# EAGLE design nav (EAGLE 7.4.0)
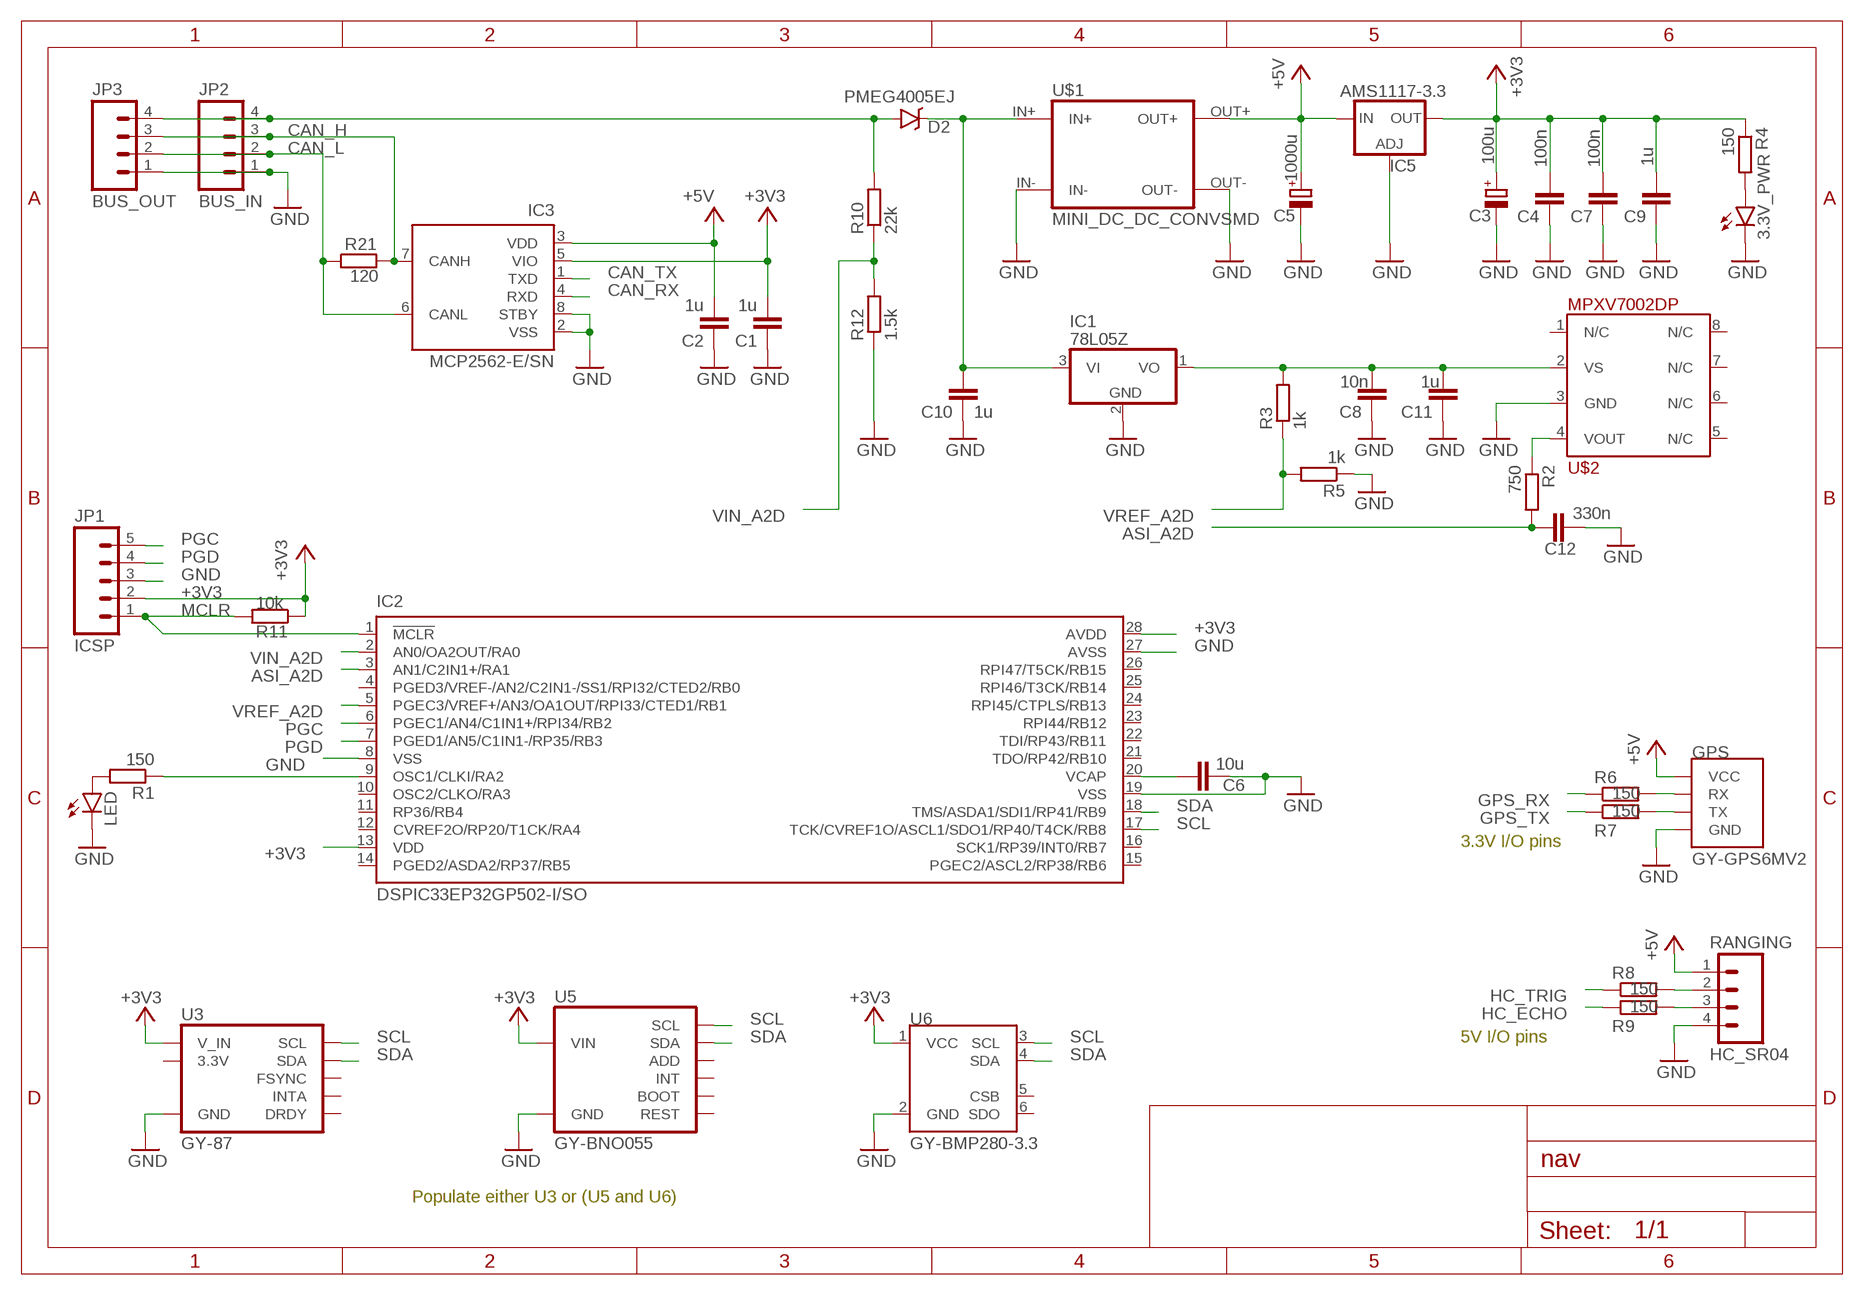
[diagram p0: schematic, sheet 1]

## Parts
3.3V_PWR  LED-FKIT-1206  [FKIT-LED-1206]
C1  1u  C-EUC0603K  [C0603K]
C2  1u  C-EUC0603K  [C0603K]
C3  100u  CPOL-EUE2.5-7  [E2,5-7]
C4  100n  C-EUC0603K  [C0603K]
C5  1000u  CPOL-EUE3.5-8  [E3,5-8]
C6  10u  C-EUC0805K  [C0805K]
C7  100n  C-EUC0603K  [C0603K]
C8  10n  C-EUC0603K  [C0603K]
C9  1u  C-EUC0603  [C0603]
C10  1u  C-EUC0603  [C0603]
C11  1u  C-EUC0603K  [C0603K]
C12  330n  C-EUC0603K  [C0603K]
D2  PMEG4005EJ  DIODE-SCHOTTKY-PMEG4005EJ  [SOD-323]
GPS  GY-GPS6MV2  [GY-GPS6MV2]
IC1  78L05Z  [TO92]
IC2  DSPIC33EP32GP502-I/SO  [SO28W]
IC3  MCP2562-E/SN  [SO-08]
IC5  AMS1117-3.3  LD117AS33TR  [SOT223]
JP1  ICSP  M05PTH  [1X05]
JP2  BUS_IN  M04PTH  [1X04]
JP3  BUS_OUT  M04PTH  [1X04]
LED  LED-FKIT-1206  [FKIT-LED-1206]
R1  150  R-EU_R0603  [R0603]
R2  750  R-EU_R0603  [R0603]
R3  1k  R-EU_R0603  [R0603]
R4  150  R-EU_R0603  [R0603]
R5  1k  R-EU_R0603  [R0603]
R6  150  R-EU_R0603  [R0603]
R7  150  R-EU_R0603  [R0603]
R8  150  R-EU_R0603  [R0603]
R9  150  R-EU_R0603  [R0603]
R10  22k  R-EU_R0603  [R0603]
R11  10k  R-EU_R0603  [R0603]
R12  1.5k  R-EU_R0603  [R0603]
R21  120  R-EU_R0603  [R0603]
RANGING  HC_SR04  M04PTH  [1X04]
U3  GY-87  [GY-87]
U5  GY-BNO055  [GY-BNO055]
U6  GY-BMP280-3.3  [GY-BMP280-3.3]
U$1  MINI_DC_DC_CONVSMD  [DSN-MINI-360-SMD]
U$2  MPXV7002DP  [MPXV7002DP]

## Nets
+3V3: C1.2 C3.+ C4.2 C7.2 C9.2 IC2.13(VDD) IC2.28(AVDD) IC3.5(VIO) IC5.2(OUT) IC5.@2(OUT) JP1.2 R4.1 R11.1 U3.VCC_IN(V_IN) U5.VIN U6.1(VCC)
+5V: C2.2 C5.+ GPS.VCC IC3.3(VDD) IC5.3(IN) RANGING.1 U$1.OUT+
ASI_A2D: C12.2 IC2.3(AN1/C2IN1+/RA1) R2.2
CAN_H: IC3.7(CANH) JP2.3 JP3.3 R21.2
CAN_L: IC3.6(CANL) JP2.2 JP3.2 R21.1
CAN_RX: IC3.4(RXD)
CAN_TX: IC3.1(TXD)
GND: 3.3V_PWR.C C1.1 C2.1 C3.- C4.1 C5.- C6.1 C7.1 C8.1 C9.1 C10.1 C11.1 C12.1 GPS.GND IC1.2(GND) IC2.8(VSS) IC2.19(VSS) IC2.27(AVSS) IC3.2(VSS) IC3.8(STBY) IC5.1(ADJ) JP1.3 JP2.1 JP3.1 LED.C R5.1 R12.1 RANGING.4 U3.GND U5.GND U6.2(GND) U$1.IN- U$1.OUT- U$2.3(GND)
GPS_RX: R6.1
GPS_TX: R7.1
HC_ECHO: R9.1
HC_TRIG: R8.1
MCLR: IC2.1(!MCLR!) JP1.1 R11.2
N$1: C8.2 C11.2 IC1.1(VO) R3.2 U$2.2(VS)
N$2: GPS.RX R6.2
N$3: 3.3V_PWR.A R4.2
N$4: LED.A R1.2
N$5: R2.1 U$2.4(VOUT)
N$6: GPS.TX R7.2
N$7: R8.2 RANGING.2
N$8: R9.2 RANGING.3
N$10: IC2.9(OSC1/CLKI/RA2) R1.1
PGC: IC2.6(PGEC1/AN4/C1IN1+/RPI34/RB2) JP1.5
PGD: IC2.7(PGED1/AN5/C1IN1-/RP35/RB3) JP1.4
SCL: IC2.17(TCK/CVREF1O/ASCL1/SDO1/RP40/T4CK/RB8) U3.SCL U5.SCL U6.3(SCL)
SDA: IC2.18(TMS/ASDA1/SDI1/RP41/RB9) U3.SDA U5.SDA U6.4(SDA)
VCAP: C6.2 IC2.20(VCAP)
VIN: D2.A JP2.4 JP3.4 R10.2
VIN_A2D: IC2.2(AN0/OA2OUT/RA0) R10.1 R12.2
VIN_D: C10.2 D2.C IC1.3(VI) U$1.IN+
VREF_A2D: IC2.5(PGEC3/VREF+/AN3/OA1OUT/RPI33/CTED1/RB1) R3.1 R5.2
Unconnected: IC2.4(PGED3/VREF-/AN2/C2IN1-/SS1/RPI32/CTED2/RB0) IC2.10(OSC2/CLKO/RA3) IC2.11(RP36/RB4) IC2.12(CVREF2O/RP20/T1CK/RA4) IC2.14(PGED2/ASDA2/RP37/RB5) IC2.15(PGEC2/ASCL2/RP38/RB6) IC2.16(SCK1/RP39/INT0/RB7) IC2.21(TDO/RP42/RB10) IC2.22(TDI/RP43/RB11) IC2.23(RPI44/RB12) IC2.24(RPI45/CTPLS/RB13) IC2.25(RPI46/T3CK/RB14) IC2.26(RPI47/T5CK/RB15) U3.DRDY U3.FSYNC U3.INTA U5.ADD U5.BOOT U5.INT U5.REST U6.5(CSB) U6.6(SDO) U$2.1(N/C) U$2.5(N/C) U$2.6(N/C) U$2.7(N/C) U$2.8(N/C)

## Notes on the sheet
- 3.3V I/O pins
- 5V I/O pins
- Populate either U3 or (U5 and U6)

## Power pins joined to a net without a drawn wire
3.3V: U3.3.3V

## Library data of the parts
3.3V_PWR LED = SparkFun-LED:LED: LEDs Standard schematic elements and footprints for 5mm, 3mm, 1206, and 0603 sized LEDs. 5mm - Spark Fun Electronics SKU : COM-00529 (and others)
C1 C2 C4 C6-C12 = rcl:C-EU: CAPACITOR, European symbol
C3 C5 = rcl:CPOL-EU: POLARIZED CAPACITOR, European symbol
D2 = SparkFun-DiscreteSemi:DIODE-SCHOTTKY: Schottky diodes in SFE's production catalog BAT20J 1A 23V 0.62Vf RB751 120mA 40V 0.37Vf PMEG4005EJ 0.5A 40V 0.42Vf MBRA140 1A 40V 0.5Vf B340A 3A 40V SMA; PROD_ID: DIO-10955
GPS = aliexpress_modules:GY-GPS6MV2: Ublox NEO6M Module. Onboard linear 3.3V LDO regulator
IC1 = linear:78*: Positive VOLTAGE REGULATOR Source: http://cache.national.com/ds/LM/LM78L05.pdf http://www.fairchildsemi.com/ds/LM/LM7805.pdf
IC2 = microchip:DSPIC33EP*502?: 16-Bit Microcontrollers and Digital Signal Controllers with High-Speed PWM, Op Amps and Advanced Analog Source: ww1.microchip.com/downloads/en/DeviceDoc/70000657H.pdf
IC3 = microchip:MCP2562: High-Speed CAN Transceiver Source: http://ww1.microchip.com/downloads/en/DeviceDoc/20005167C.pdf
IC5 = v-reg:LD117A?*: Low drop fixed and adjustable positive voltage regulators 1 A Source: http://www.st.com/stonline/products/literature/ds/7194/ld1117axx.pdf
JP1 = SparkFun-Connectors:M05: Header 5 Standard 5-pin 0.1" header. Use with straight break away headers (SKU : PRT-00116), right angle break away headers (PRT-00553), swiss pins (PRT-00743), machine pins (PRT-00117), and female headers (PRT-00115). Molex polarized connector foot print use with SKU : PRT-08230 with associated crimp pins and housings.
JP2 JP3 RANGING = SparkFun-Connectors:M04: Header 4 Standard 4-pin 0.1" header. Use with straight break away headers (SKU : PRT-00116), right angle break away headers (PRT-00553), swiss pins (PRT-00743), machine pins (PRT-00117), and female headers (PRT-00115). Molex polarized connector foot print use with SKU : PRT-08231 with associated crimp pins and housings. 1MM SMD Version SKU: PRT-10208
R1-R12 R21 = rcl:R-EU_: RESISTOR, European symbol
U3 = aliexpress_modules:GY-87: GY-87 10DOF MPU6050 HMC5883L BMP180 module
U5 = aliexpress_modules:GY-BNO055: GY-BNO055 9DOF module with sensor fusion algorithms. Internal 10k pullups on ADD,BOOT,SCL,SDA,REST
U6 = aliexpress_modules:GY-BMP280-3.3: High Precision Atmospheric Pressure Sensor Module For Arduino
U$1 = aliexpress_modules:MINI_DC_DC_CONV: RC Airplane Module Mini 360 DC Buck Converter Step Down Module 4.75V-23V to 1V-17V 17x11x3.8mm New LM2596; $1.06 Input voltage: 4.75V-23V; Output voltage: 1.0V-17V; Current output: peak 3A, 1.8A long time
U$2 = aliexpress_modules:MPXV7002DP: MPXV7002 Integrated Silicon Pressure Sensor On-Chip Signal Conditioned, Temperature Compensated and Calibrated

## Board
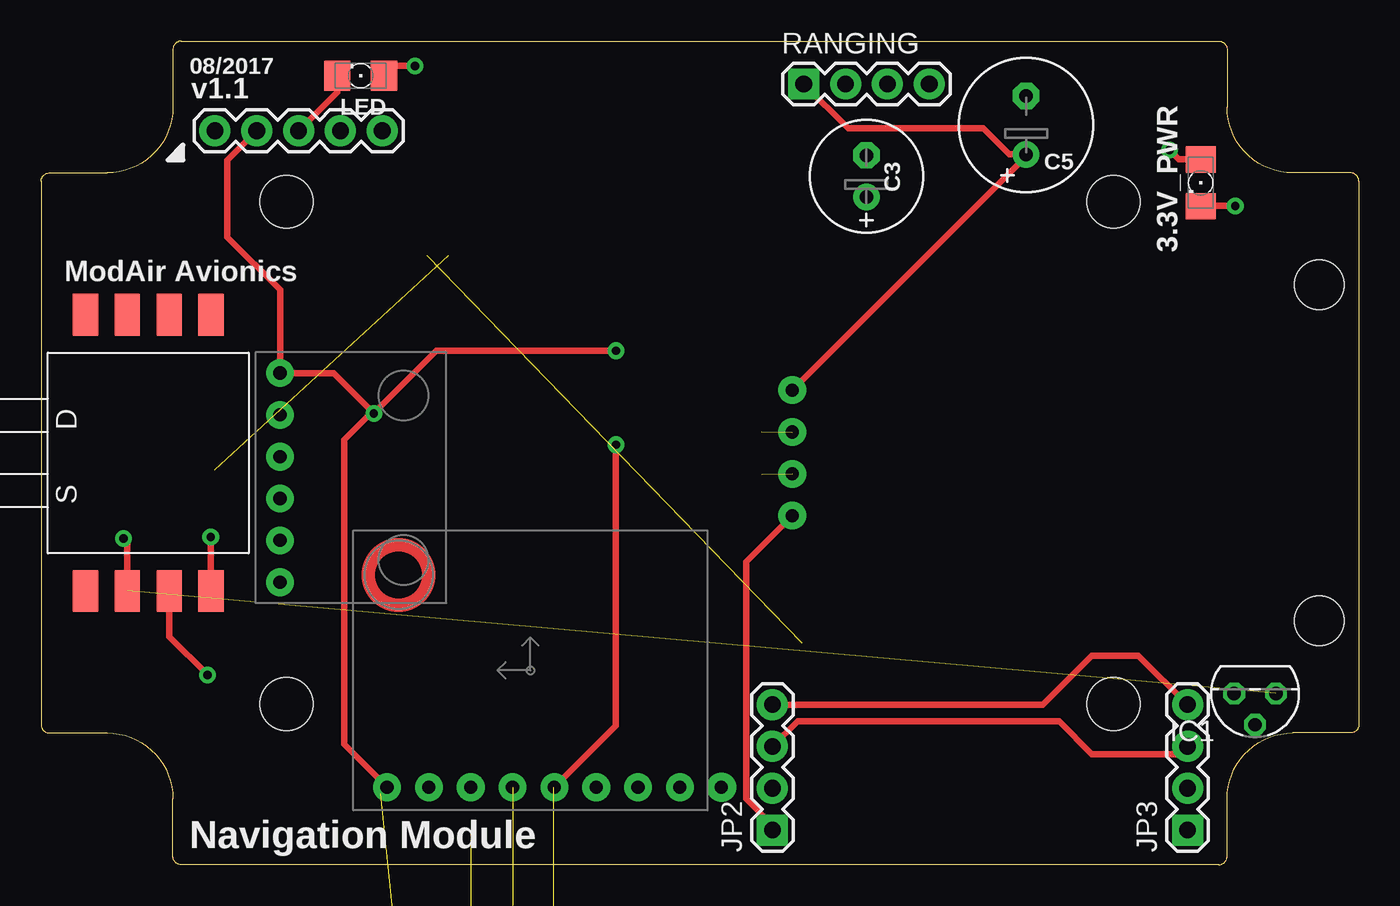
[diagram p1: board, top side]
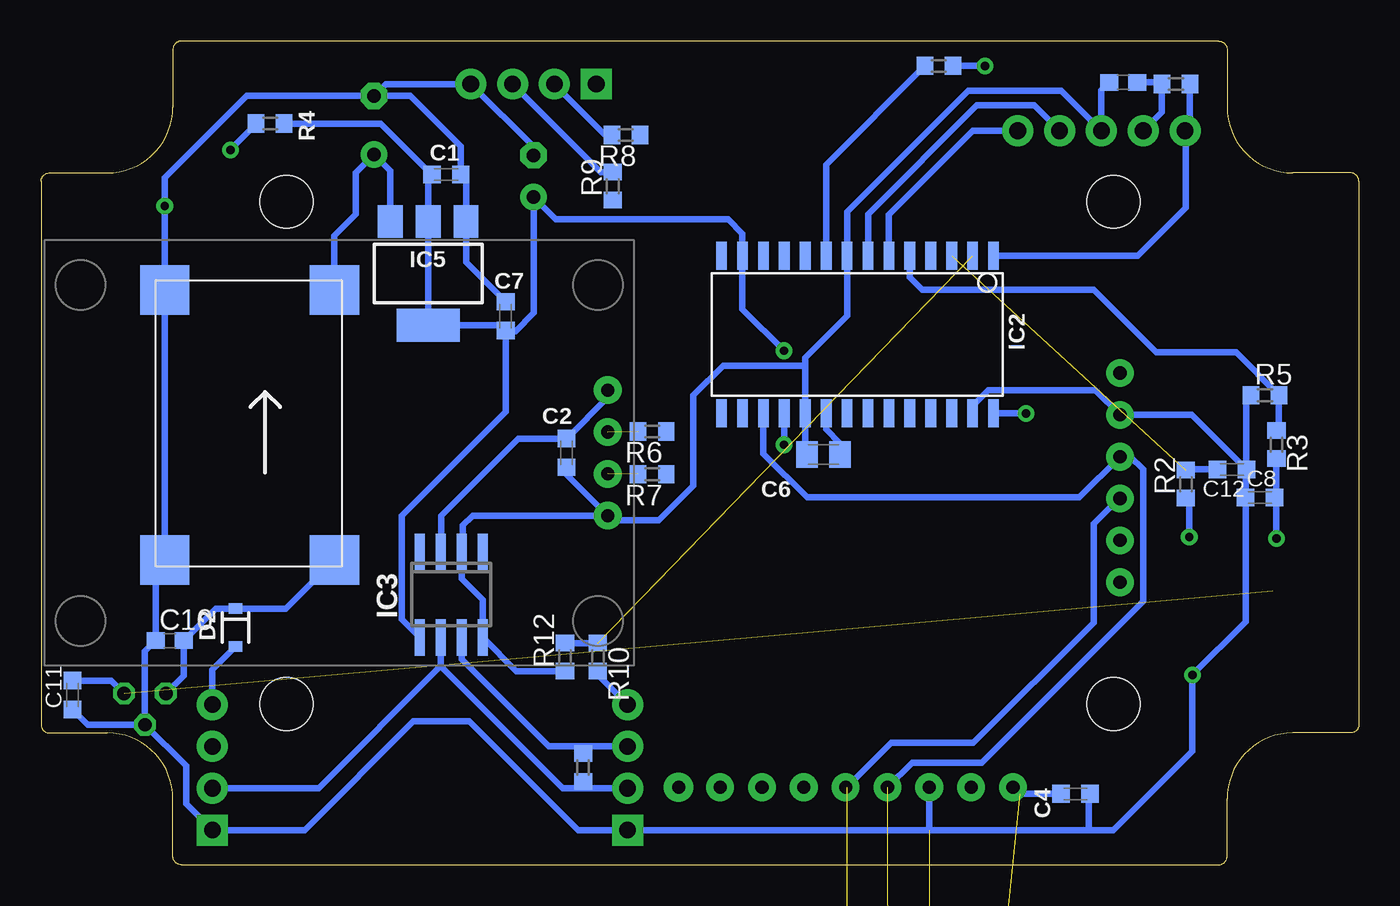
[diagram p2: board, bottom side, seen from below]

Size 80 x 50 mm. Coordinates in mm from the lower left corner, seen from the top.
Outline: 80,41.5 80,8.5 arc-90 79.5,8 76,8 arc90 72,4 72,0.5 arc-90 71.5,0 8.5,0 arc-90 8,0.5 8,4 arc90 4,8 0.5,8 arc-90 0,8.5 0,41.5 arc-90 0.5,42 4,42 arc90 8,46 8,49.5 arc-90 8.5,50 71.5,50 arc-90 72,49.5 72,46 arc90 76,42 79.5,42 arc-90 80,41.5
Copper layers (1*16): Top 0.035mm / dielectric 1.5mm / Bottom 0.035mm
Design rules "ITEAD_DRU_CHECK": minimum track width 6mil, minimum drill 12mil, track to track 6mil, track to pad 6mil, pad to pad 6mil, via to via 6mil, smd to smd 0mil, copper to edge 10mil, drill to drill 10mil, minimum pad ring 10mil, minimum via ring 6mil, stop-mask expansion 2mil, vias tented up to drill 100mil, thermal gap 10mil
Holes 3.2 mm at 14.9,9.75 14.9,40.25 65.1,9.75 65.1,40.25
Holes 3 mm at 77.6,35.2 77.6,14.8
tKeepout: 16 lines
bKeepout: area 62.6,37.8 to 67.6,42.8; area 62.6,7.2 to 67.6,12.2; area 12.4,7.2 to 17.4,12.2; area 12.4,37.8 to 17.4,42.8
tRestrict: area 12.2,37.5 to 17.6,43; area 62.4,37.5 to 67.8,43; area 62.4,7.1 to 67.8,12.4; area 12.2,7.1 to 17.6,12.4

### Footprints (pad centres in the part's own frame; a part is rotated, then mirrored left to right if it is on the bottom)
FKIT-LED-1206 = smd 1.6 x 1.803: A -1.422,0; C 1.422,0
C0603K = smd 1.05 x 1.08: 1 -0.875,0; 2 0.875,0
E2,5-7 = drill 0.813 pad 1.6: + -1.27,0 | drill 0.813 pad 1.6 octagon: - 1.27,0
E3,5-8 = drill 0.813 pad 1.6: + -1.778,0 | drill 0.813 pad 1.6 octagon: - 1.778,0
C0805K = smd 1.3 x 1.6: 1 -1,0; 2 1,0
C0603 = smd 1.1 x 1: 1 -0.85,0; 2 0.85,0
SOD-323 = smd 0.63 x 0.83: A 1.15,0; C -1.15,0
GY-GPS6MV2 = drill 0.8 pad 1.676: GND 3.81,16.3; RX -1.27,16.3; TX 1.27,16.3; VCC -3.81,16.3
TO92 = drill 0.813 octagon: 1 -1.27,0; 2 0,1.905; 3 1.27,0
SO28W = smd 0.65 x 1.7: 1 -7.62,-4.78; 2 -6.35,-4.78; 3 -5.08,-4.78; 4 -3.81,-4.78; 5 -2.54,-4.78; 6 -1.27,-4.78; 7 0,-4.78; 8 1.27,-4.78; 9 2.54,-4.78; 10 3.81,-4.78; 11 5.08,-4.78; 12 6.35,-4.78; 13 7.62,-4.78; 14 8.89,-4.78; 15 8.89,4.78; 16 7.62,4.78; 17 6.35,4.78; 18 5.08,4.78; 19 3.81,4.78; 20 2.54,4.78; 21 1.27,4.78; 22 0,4.78; 23 -1.27,4.78; 24 -2.54,4.78; 25 -3.81,4.78; 26 -5.08,4.78; 27 -6.35,4.78; 28 -7.62,4.78
SO-08 = smd 0.6 x 2.2: 1 -1.905,-2.6; 2 -0.635,-2.6; 3 0.635,-2.6; 4 1.905,-2.6; 5 1.905,2.6; 6 0.635,2.6; 7 -0.635,2.6; 8 -1.905,2.6
SOT223 = smd 1.5 x 2: 1 -2.3,-3.15; 2 0,-3.15; 3 2.3,-3.15 | smd 3.8 x 2: @2 0,3.15
1X05 = drill 1.016 pad 1.88: 1 0,0; 2 2.54,0; 3 5.08,0; 4 7.62,0; 5 10.16,0
1X04 = drill 1.016 pad 1.88 square: 1 0,0 | drill 1.016 pad 1.88: 2 2.54,0; 3 5.08,0; 4 7.62,0
R0603 = smd 1 x 1.1: 1 -0.85,0; 2 0.85,0
GY-87 = drill 0.8 pad 1.676: 3.3V -7.1,6.16; DRDY -7.1,-9.08; FSYNC -7.1,-4; GND -7.1,3.62; INTA -7.1,-6.54; SCL -7.1,1.08; SDA -7.1,-1.46; VCC_IN -7.1,8.7
GY-BNO055 = drill 0.8 pad 1.676: ADD -4.75,-1.36; BOOT -4.75,-6.44; GND -4.75,6.26; INT -4.75,-3.9; REST -4.75,-8.98; SCL -4.75,3.72; SDA -4.75,1.18; VIN -4.75,8.8
GY-BMP280-3.3 = drill 0.8 pad 1.676: 1 4.3,-6.35; 2 4.3,-3.81; 3 4.3,-1.27; 4 4.3,1.27; 5 4.3,3.81; 6 4.3,6.35
DSN-MINI-360-SMD = smd 3 x 3: IN+ 8.3,5.2; IN- 8.3,-5.1; OUT+ -8.1,5.2; OUT- -8.1,-5.1
MPXV7002DP = smd 2.54 x 1.524: 1 8.382,-3.81; 2 8.382,-1.27; 3 8.382,1.27; 4 8.382,3.81; 5 -8.382,3.81; 6 -8.382,1.27; 7 -8.382,-1.27; 8 -8.382,-3.81

### Placement (x,y rotation side)
3.3V_PWR  70.4,41.4 270 top
C1  55.4,41.9 180 bottom
C2  48.1,25 90 bottom
C3  50.1,41.8 90 top
C4  17.2,4.3 180 bottom
C5  59.8,44.9 90 top
C6  32.5,24.9 0 bottom
C7  51.8,33.3 270 bottom
C8  6,22.3 0 bottom
C9  14.3,47.5 0 bottom
C10  72.2,13.6 0 bottom
C11  78.1,10.3 90 bottom
C12  7.7,24 180 bottom
D2  68.2,14.4 270 bottom
GPS  61.9,25 270 bottom
IC1  73.7,10.4 180 top
IC2  29.8,32.2 180 bottom
IC3  55.1,16.4 180 bottom
IC5  56.5,35.9 180 bottom
JP1  10.55,44.56 0 top
JP2  44.4,2.1 90 top
JP3  69.6,2.1 90 top
LED  19.4,47.9 180 top
R1  25.5,48.5 0 bottom
R2  10.5,23.1 90 bottom
R3  5,25.5 270 bottom
R4  66.1,45 180 bottom
R5  5.7,28.5 0 bottom
R6  42.9,26.3 180 bottom
R7  42.9,23.7 180 bottom
R8  44.5,44.3 180 bottom
R9  45.3,41.2 90 bottom
R10  46.2,12.6 270 bottom
R11  11.1,47.4 0 bottom
R12  48.2,12.6 90 bottom
R21  47.1,5.9 90 bottom
RANGING  46.3,47.4 0 top
U3  29.7,11.8 90 top
U5  32.3,-19.3 90 top  (outside the outline)
U6  18.8,23.5 180 top
U$1  67.4,26.8 270 bottom
U$2  6.5,25 270 top

### Tracks (layer width: path | path; a pad name or v marks a point on that pad's centre or on a via)
+3V3  (via drill 0.5 pad 1.02)  (1 unrouted)
  Top 0.406: JP1.2 11.3,42.77 11.3,38.1 14.5,34.9 U6.1 17.75,29.85 v20.2,27.4 | U3.VCC_IN 18.4,7.3 18.4,25.8 20,27.4 v20.2,27.4 | v34.9,31.2 24,31.2 v20.2,27.4
  Bottom 0.406: R4.1 59.38,45 C1.2 56.5,41.67 IC5.2 IC5.@2 52.12,32.75 C7.2 | C7.2 51.8,27.5 58.1,21.2 58.1,14.89 IC3.5 | C7.2 51.77,32.4 51.2,32.4 50.1,33.5 C3.+ 48.77,39.2 38.3,39.2 37.42,38.32 IC2.13 37.42,33.72 v34.9,31.2 | U3.VCC_IN 20.6,4.3 C4.2 | v20.2,27.4 22.16,27.4 IC2.28 | JP1.2 11.95,45.7 R11.1 12.05,47.5 C9.2
+5V
  Top 0.406: RANGING.1 49,44.7 57.2,44.7 58.78,43.12 C5.+ 59.8,43.01 GPS.VCC
  Bottom 0.406: U$1.OUT+ 62.2,38.2 60.9,39.5 60.9,42.02 C5.+ 58.8,42.12 IC5.3 | GPS.VCC 45.6,28.38 C2.2 51.02,25.88 55.7,21.2 55.7,19.04 IC3.3
ASI_A2D  (1 unrouted)
  Bottom 0.406: R2.2 10.45,24 C12.2
CAN_H
  Top 0.406: JP2.3 45.92,8.7 61.8,8.7 63.8,6.7 69.12,6.7 JP3.3
  Bottom 0.406: IC3.7 54.47,12.46 49.18,7.18 47.2,7.18 | 47.2,7.18 JP2.3 | R21.2 47.1,7.08 47.2,7.18
CAN_L
  Bottom 0.406: JP2.2 47.3,4.64 | 47.3,4.64 48.34,4.64 55.73,12.04 IC3.6 55.73,12.06 63.16,4.64 JP3.2 | R21.1 47.1,4.84 47.3,4.64
GND  (via drill 0.5 pad 1.02)  (1 unrouted)
  Top 0.406: v72.5,40 70.42,40 3.3V_PWR.C | GPS.GND 42.8,18.39 42.8,4 44.4,2.4 JP2.1 | v10.1,11.52 7.77,13.85 U$2.3 | JP1.3 17.98,46.91 LED.C
  Bottom 0.406: IC1.2 71.2,6 71.2,3.7 JP3.1 64,2.1 57.4,8.7 54,8.7 47.4,2.1 JP2.1 26.08,2.1 | IC1.2 77.17,8.5 C11.1 | IC1.2 73.7,12.95 C10.1 73.05,17.95 U$1.IN- U$1.OUT- v72.5,40 72.5,41.7 67.52,46.68 C5.- | C5.- 57.58,46.68 54.52,43.62 C1.1 54.2,41.58 IC5.1 54.2,36.58 C7.1 | U3.GND 26.08,2.1 | 26.08,2.1 16.4,2.1 | 16.4,2.1 14.9,2.1 10.1,6.9 v10.1,11.52 6.88,14.74 C8.1 6.88,23.95 C12.1 | GPS.GND 53.81,21.19 54.4,20.6 54.4,19.07 IC3.2 54.47,17.37 53.2,16.1 IC3.8 51.14,11.75 R12.1 | C2.1 48.1,23.69 GPS.GND | C5.- 59.08,47.4 RANGING.4 50.1,43.58 C3.- | C4.1 16.4,4.23 16.4,2.1 | C12.1 10.14,27.31 U6.2 15.99,28.8 22.5,28.8 23.45,27.85 IC2.27 | R5.1 6.83,28.23 C12.1 | C9.1 15.63,47.02 JP1.3 18.07,47 23.7,47 31.07,39.63 IC2.8 31.07,33.33 33.61,30.79 33.61,30.2 | 33.61,30.2 IC2.19 33.61,25.01 C6.1 | GPS.GND 45.31,20.9 42.5,20.9 40.4,23 40.4,28.5 38.6,30.3 33.71,30.3 33.61,30.2
MCLR
  Bottom 0.406: R11.2 10.25,44.86 JP1.1 10.5,44.51 10.5,39.9 13.42,36.98 IC2.1
N$1  (via drill 0.5 pad 1.02)  (1 unrouted)
  Top 0.406: v5,19.8 5.23,19.57 U$2.2
  Bottom 0.406: C11.2 75.75,11.18 IC1.1 | R3.2 5,22.43 C8.2 5,22.18 v5,19.8
N$2  (1 unrouted)
N$3  (via drill 0.5 pad 1.02)
  Top 0.406: 3.3V_PWR.A 69.08,42.82 v68.5,43.4
  Bottom 0.406: v68.5,43.4 68.5,43.45 R4.2
N$4  (via drill 0.5 pad 1.02)
  Top 0.406: v22.7,48.5 21.42,48.5 LED.A
  Bottom 0.406: v22.7,48.5 R1.2
N$5  (via drill 0.5 pad 1.02)
  Top 0.406: U$2.4 v10.31,19.89 v10.3,19.9
  Bottom 0.406: v10.3,19.9 10.3,22.05 R2.1
N$6  (1 unrouted)
N$7
  Bottom 0.406: RANGING.2 45.74,44.3 R8.2
N$8
  Bottom 0.406: RANGING.3 46.03,42.05 R9.2
N$9  (via drill 0.8 pad 1.78)
  other vias: 41.3,4.7
N$10
  Bottom 0.406: R1.1 32.34,42.51 IC2.9
PGC
  Bottom 0.406: JP1.5 23.44,44.56 28.53,39.47 IC2.6
PGD
  Bottom 0.406: JP1.4 19.71,46.1 23.2,46.1 29.8,39.5 IC2.7
SCL  (1 unrouted)
  Bottom 0.406: U3.SCL 27.12,6.2 22.9,6.2 13.1,16 13.1,24 13.87,24.77 U6.3 16.97,22.3 33.5,22.3 36.15,24.95 IC2.17
SDA  (via drill 0.5 pad 1.02)  (1 unrouted)
  Top 0.406: v34.9,25.5 34.9,8.44 U3.SDA
  Bottom 0.406: U3.SDA 31.1,4.7 28.4,7.4 23.4,7.4 16.1,14.7 16.1,20.7 14.57,22.23 U6.4 | IC2.18 34.9,27.44 v34.9,25.5
VCAP
  Bottom 0.406: IC2.20 32.34,26.44 31.5,25.6 C6.2
VIN
  Top 0.406: JP2.4 44.42,9.7 60.8,9.7 63.8,12.7 66.62,12.7 JP3.4
  Bottom 0.406: JP3.4 69.6,11.85 D2.A | JP2.4 46.2,11.52 R10.2
VIN_A2D  (1 unrouted)
  Bottom 0.406: R12.2 R10.1
VIN_D
  Bottom 0.406: IC1.3 71.35,11.48 C10.2 69.4,15.55 D2.C 65.15,15.55 U$1.IN+
VREF_A2D
  Bottom 0.406: R3.1 4.85,26.5 R5.2 7.45,31.1 12.3,31.1 16.1,34.9 26.5,34.9 27.26,35.66 IC2.5
(copper drawn outside any net)
  shapes: Top circle x1

### Text on the board
tPlace: 08/2017 | v1.1 | ModAir Avionics | Navigation Module
Document: Copper to Edge: >0.3mm | Outline Dimension Accuracy: +- 0.2mm | Bottom Extrude: Max 4.5mm | Top Extrude: Max 16.9mm